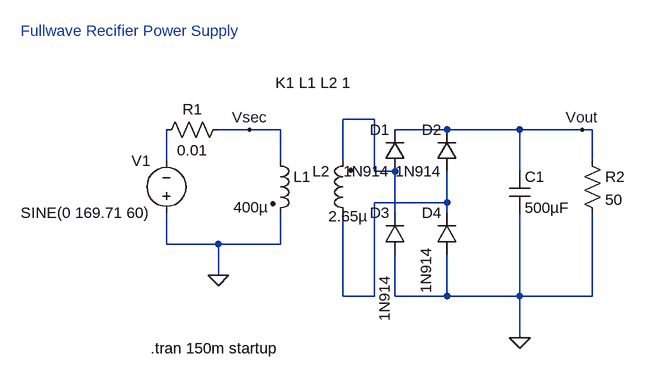
[diagram p0: schematic Full wave Power Supply.asc]
Full wave Power Supply.asc, the LTspice schematic file:
Version 4
SHEET 1 880 680
WIRE -624 -288 -672 -288
WIRE -816 -272 -864 -272
WIRE -768 -272 -816 -272
WIRE -512 -272 -592 -272
WIRE -400 -272 -512 -272
WIRE -304 -272 -400 -272
WIRE -288 -272 -304 -272
WIRE -944 -224 -944 -272
WIRE -768 -224 -768 -272
WIRE -672 -224 -672 -288
WIRE -288 -224 -288 -272
WIRE -624 -208 -624 -288
WIRE -592 -208 -624 -208
WIRE -400 -208 -400 -272
WIRE -512 -160 -512 -208
WIRE -512 -160 -624 -160
WIRE -592 -144 -592 -208
WIRE -512 -144 -512 -160
WIRE -944 -96 -944 -144
WIRE -864 -96 -944 -96
WIRE -768 -96 -768 -144
WIRE -768 -96 -864 -96
WIRE -864 -48 -864 -96
WIRE -672 -16 -672 -144
WIRE -624 -16 -624 -160
WIRE -624 -16 -672 -16
WIRE -592 -16 -592 -80
WIRE -512 -16 -512 -80
WIRE -512 -16 -592 -16
WIRE -400 -16 -400 -144
WIRE -400 -16 -512 -16
WIRE -288 -16 -288 -144
WIRE -288 -16 -400 -16
WIRE -400 48 -400 -16
FLAG -864 -48 0
FLAG -400 48 0
FLAG -304 -272 Vout
FLAG -816 -272 Vsec
SYMBOL res -960 -256 R270
WINDOW 0 32 56 VTop 2
WINDOW 3 0 56 VBottom 2
SYMATTR InstName R1
SYMATTR Value 0.01
SYMBOL voltage -944 -128 R180
WINDOW 0 24 96 Left 2
WINDOW 3 24 16 Left 2
WINDOW 123 0 0 Left 2
WINDOW 39 0 0 Left 2
SYMATTR InstName V1
SYMATTR Value SINE(0 169.71 60)
SYMBOL ind2 -784 -240 R0
WINDOW 3 -57 87 Left 2
SYMATTR Value 400µ
SYMATTR InstName L1
SYMATTR Type ind
SYMBOL ind2 -656 -128 R180
WINDOW 0 36 80 Left 2
WINDOW 3 -22 11 Left 2
SYMATTR InstName L2
SYMATTR Value 2.65µ
SYMATTR Type ind
SYMBOL diode -576 -208 R180
WINDOW 0 24 64 Left 2
WINDOW 3 24 0 Left 2
SYMATTR InstName D1
SYMATTR Value 1N914
SYMBOL diode -496 -208 R180
WINDOW 0 24 64 Left 2
WINDOW 3 24 0 Left 2
SYMATTR InstName D2
SYMATTR Value 1N914
SYMBOL diode -576 -80 R180
WINDOW 0 24 64 Left 2
WINDOW 3 32 -103 VRight 2
SYMATTR InstName D3
SYMATTR Value 1N914
SYMBOL diode -496 -80 R180
WINDOW 0 24 64 Left 2
WINDOW 3 48 -60 VRight 2
SYMATTR InstName D4
SYMATTR Value 1N914
SYMBOL cap -416 -208 R0
SYMATTR InstName C1
SYMATTR Value 500µF
SYMBOL res -304 -240 R0
SYMATTR InstName R2
SYMATTR Value 50
TEXT -968 64 Left 2 !.tran 150m startup
TEXT -776 -344 Left 2 !K1 L1 L2 1
TEXT -1168 -424 Left 2 ;Fullwave Recifier Power Supply

The netlist it stands for:
* Full wave Power Supply.asc
R1 N002 Vsec 0.01
V1 0 N002 SINE(0 169.71 60)
L1 Vsec 0 400µ
L2 N003 N001 2.65µ
D1 N001 Vout 1N914
D2 N003 Vout 1N914
D3 0 N001 1N914
D4 0 N003 1N914
C1 Vout 0 500µF
R2 Vout 0 50
.model D D
.lib standard.dio
.tran 150m startup
K1 L1 L2 1
* Fullwave Recifier Power Supply
.backanno
.end